# EAGLE design lab5 (EAGLE 7.2.0)
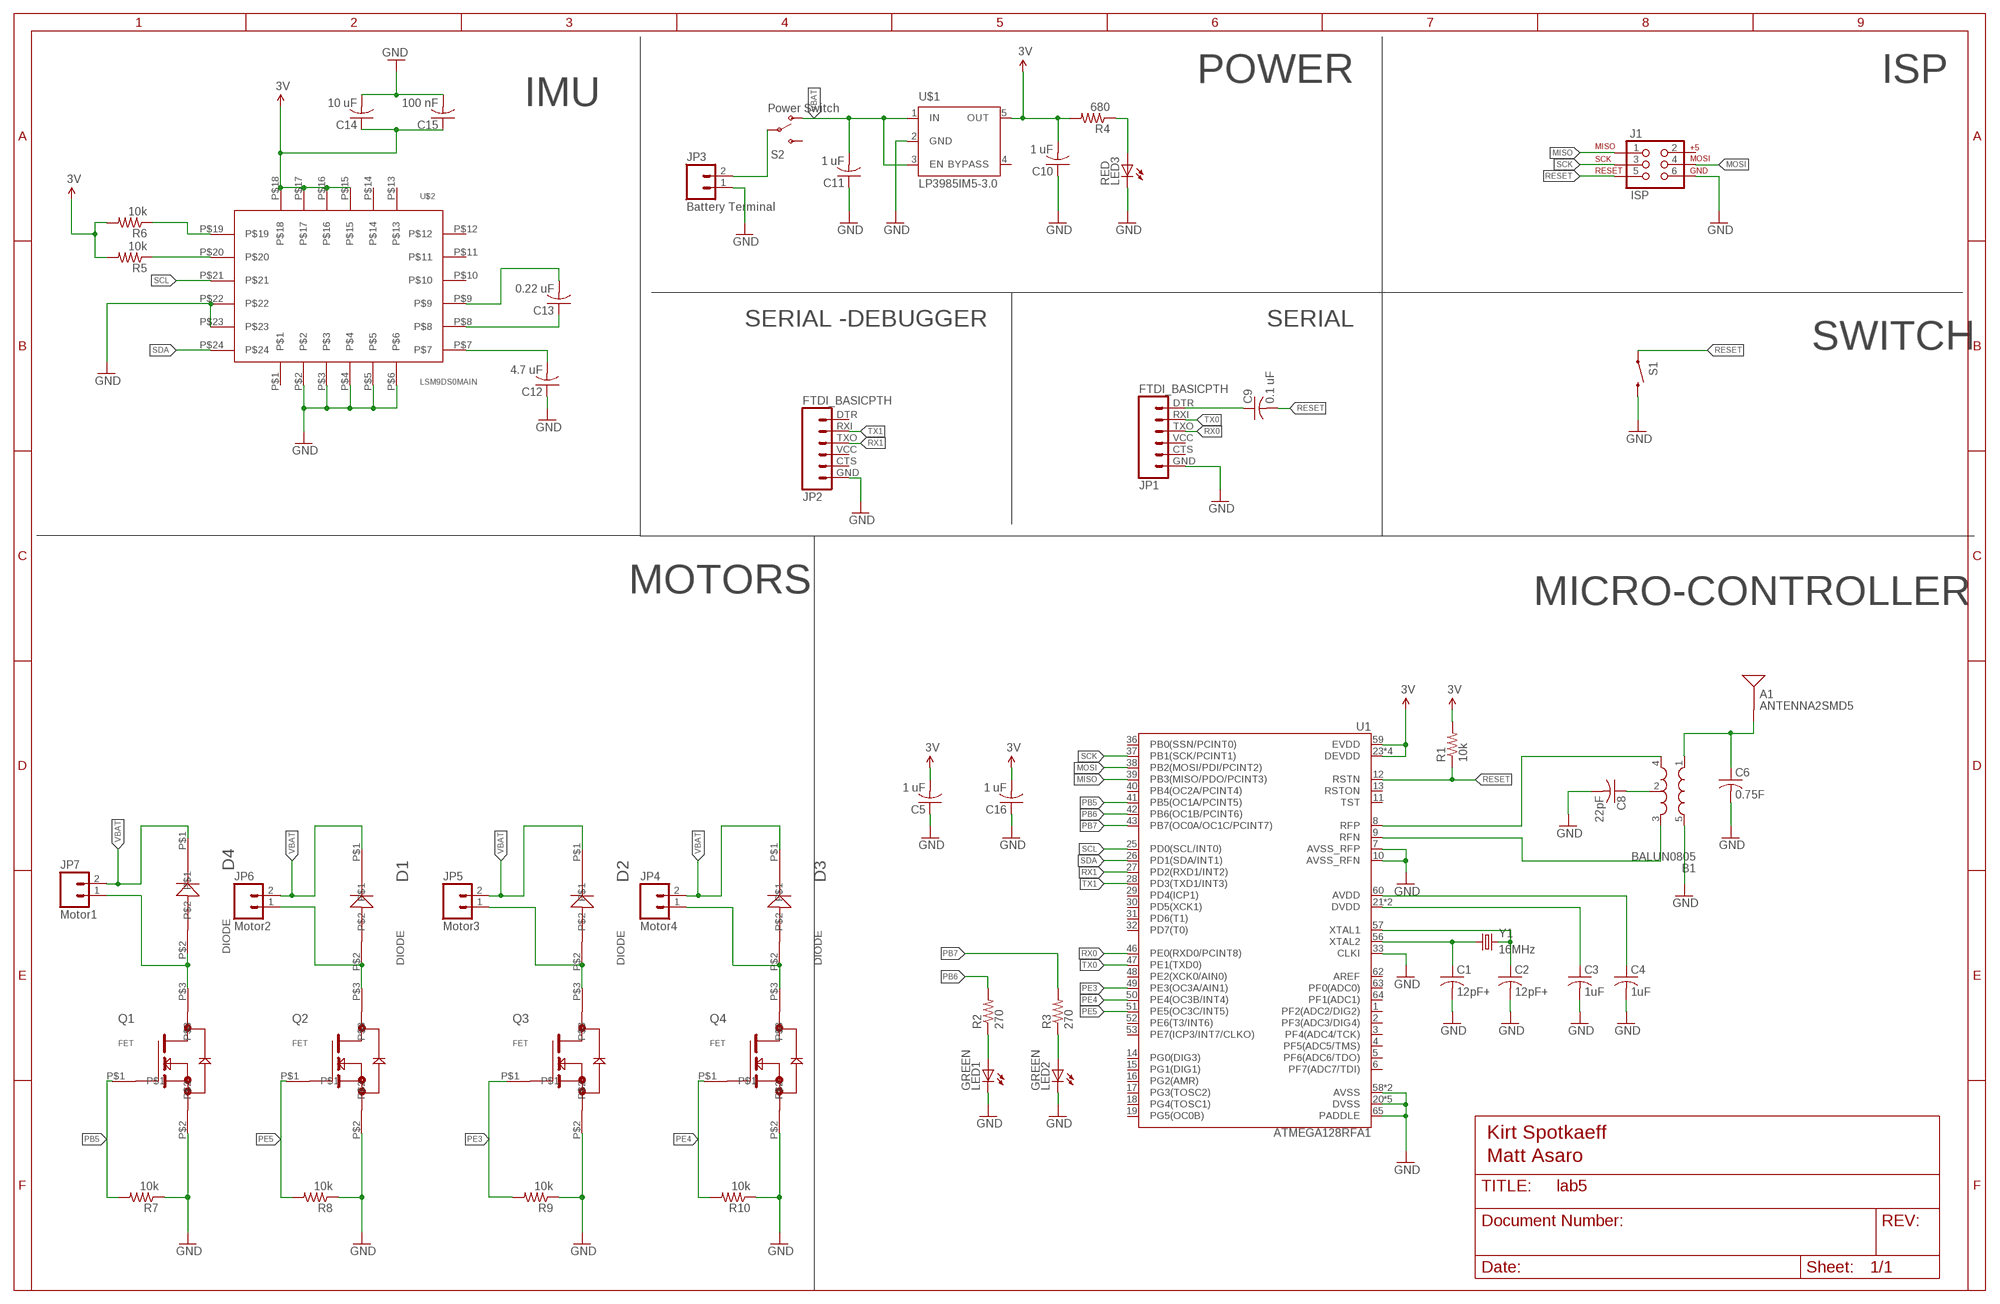
[diagram p0: schematic, sheet 1]

## Parts
A1  ANTENNA2SMD5  [ANTENNA-CHIP5]
B1  BALUN0805  [BALUN]
C1  12pF+  C-USC0805  [C0805]
C2  12pF+  C-USC0805  [C0805]
C3  1uF  C-USC0805  [C0805]
C4  1uF  C-USC0805  [C0805]
C5  1 uF  C-USC0805  [C0805]
C6  0.75F  C-USC0805  [C0805]
C8  22pF  C-USC0805  [C0805]
C9  0.1 uF  C-USC0805  [C0805]
C10  1 uF  C-USC0805  [C0805]
C11  1 uF  C-USC0805  [C0805]
C12  4.7 uF  C-USC0805  [C0805]
C13  0.22 uF  C-USC0805  [C0805]
C14  10 uF  C-USC0805  [C0805]
C15  100 nF  C-USC0805  [C0805]
C16  1 uF  C-USC0805  [C0805]
D1  DIODE  [DIODE]
D2  DIODE  [DIODE]
D3  DIODE  [DIODE]
D4  DIODE  [DIODE]
J1  ISP  AVR_SPI_PRG_6NS  [2X3-NS]
JP1  FTDI_BASICPTH  [FTDI_BASIC]
JP2  FTDI_BASICPTH  [FTDI_BASIC]
JP3  Battery Terminal  M02PTH  [1X02]
JP4  Motor4  M02PTH  [1X02]
JP5  Motor3  M02PTH  [1X02]
JP6  Motor2  M02PTH  [1X02]
JP7  Motor1  M02PTH  [1X02]
LED1  GREEN  LEDCHIP-LED0805  [CHIP-LED0805]
LED2  GREEN  LEDCHIP-LED0805  [CHIP-LED0805]
LED3  RED  LEDCHIP-LED0805  [CHIP-LED0805]
Q1  FET  [FET]
Q2  FET  [FET]
Q3  FET  [FET]
Q4  FET  [FET]
R1  10k  R-US_R0805  [R0805]
R2  270  R-US_R0805  [R0805]
R3  270  R-US_R0805  [R0805]
R4  680  R-US_R0805  [R0805]
R5  10k  R-US_R0805  [R0805]
R6  10k  R-US_R0805  [R0805]
R7  10k  R-US_R0805  [R0805]
R8  10k  R-US_R0805  [R0805]
R9  10k  R-US_R0805  [R0805]
R10  10k  R-US_R0805  [R0805]
S1  SWITCH-MOMENTARY-2SMD  [TACTILE_SWITCH_SMD]
S2  Power Switch  SWITCH-SPDTPTH  [SWITCH-SPDT]
U1  ATMEGA128RFA1  [QFN-64]
U$1  LP3985IM5-3.0  [SOT23-DBV]
U$2  LSM9DS0MAIN  [LSM9DS0]
Y1  16MHz  CRYSTAL5X3  [CRYSTAL-SMD-5X3]

## Nets
3.3V: C5.2 C10.2 C14.1 C15.1 C16.2 R1.2 R4.2 R5.2 R6.2 U1.23(DEVDD) U1.34(DEVDD) U1.44(DEVDD) U1.54(DEVDD) U1.59(EVDD) U$1.5(OUT) U$2.P$15 U$2.P$16 U$2.P$17 U$2.P$18 ; supply symbol labelled 3V
GND: B1.5(GND) C1.2 C2.2 C3.2 C4.2 C5.1 C6.2 C8.2 C10.1 C11.1 C12.1 C14.2 C15.2 C16.1 J1.6 JP1.GND JP2.GND JP3.1 LED1.C LED2.C LED3.C Q1.P$2 Q2.P$2 Q3.P$2 Q4.P$2 R7.1 R8.1 R9.1 R10.1 S1.3 U1.7(AVSS_RFP) U1.10(AVSS_RFN) U1.20(DVSS) U1.24(DVSS) U1.33(CLKI) U1.35(DVSS) U1.45(DVSS) U1.55(DVSS) U1.58(AVSS) U1.61(AVSS) U1.65(PADDLE) U$1.2(GND) U$2.P$2 U$2.P$3 U$2.P$4 U$2.P$5 U$2.P$6 U$2.P$22 U$2.P$23
MISO: J1.1 U1.39(PB3(MISO/PDO/PCINT3))
MOSI: J1.4 U1.38(PB2(MOSI/PDI/PCINT2))
N$1: C1.1 U1.56(XTAL2) Y1.1
N$2: B1.2(GND) C8.1
N$3 [HIGHCURRENT]: D1.P$2 JP6.1 Q2.P$3
N$4 [RFSIG]: A1.FEED(SIGNAL) B1.1(IN) C6.1
N$6: LED3.A R4.1
N$7: JP3.2 S2.2(P)
N$8: LED1.A R2.1
N$9: LED2.A R3.1
N$10: C9.1 JP1.DTR
N$11: C2.1 U1.57(XTAL1) Y1.3
N$12 [HIGHCURRENT]: D3.P$2 JP4.1 Q4.P$3
N$13: C3.1 U1.21(DVDD) U1.22(DVDD)
N$14: C4.1 U1.60(AVDD)
N$15 [HIGHCURRENT]: D2.P$2 JP5.1 Q3.P$3
N$16 [HIGHCURRENT]: D4.P$2 JP7.1 Q1.P$3
N$17: B1.3(OUT2) U1.9(RFN)
N$18: B1.4(OUT1) U1.8(RFP)
N$21: C12.2 U$2.P$7
N$22: C13.2 U$2.P$9
N$23: C13.1 U$2.P$8
N$28: R5.1 U$2.P$20
N$29: R6.1 U$2.P$19
PB5: Q1.P$1 R7.2 U1.41(PB5(OC1A/PCINT5))
PB6: R2.2 U1.42(PB6(OC1B/PCINT6))
PB7: R3.2 U1.43(PB7(OC0A/OC1C/PCINT7))
PE3: Q3.P$1 R9.2 U1.49(PE3(OC3A/AIN1))
PE4: Q4.P$1 R10.2 U1.50(PE4(OC3B/INT4))
PE5: Q2.P$1 R8.2 U1.51(PE5(OC3C/INT5))
RESET: C9.2 J1.5 R1.1 S1.1 U1.12(RSTN)
RX0: JP1.TXO U1.46(PE0(RXD0/PCINT8))
RX1: JP2.TXO U1.27(PD2(RXD1/INT2))
SCK: J1.3 U1.37(PB1(SCK/PCINT1))
SCL: U1.25(PD0(SCL/INT0)) U$2.P$21
SDA: U1.26(PD1(SDA/INT1)) U$2.P$24
TX0: JP1.RXI U1.47(PE1(TXD0))
TX1: JP2.RXI U1.28(PD3(TXD1/INT3))
VBAT [HIGHCURRENT]: C11.2 D1.P$1 D2.P$1 D3.P$1 D4.P$1 JP4.2 JP5.2 JP6.2 JP7.2 S2.1(O) U$1.1(IN) U$1.3(EN)
Unconnected: J1.2 JP1.CTS JP1.VCC JP2.CTS JP2.DTR JP2.VCC S2.3(S) U1.1(PF2(ADC2/DIG2)) U1.2(PF3(ADC3/DIG4)) U1.3(PF4(ADC4/TCK)) U1.4(PF5(ADC5/TMS)) U1.5(PF6(ADC6/TDO)) U1.6(PF7(ADC7/TDI)) U1.11(TST) U1.13(RSTON) U1.14(PG0(DIG3)) U1.15(PG1(DIG1)) U1.16(PG2(AMR)) U1.17(PG3(TOSC2)) U1.18(PG4(TOSC1)) U1.19(PG5(OC0B)) U1.29(PD4(ICP1)) U1.30(PD5(XCK1)) U1.31(PD6(T1)) U1.32(PD7(T0)) U1.36(PB0(SSN/PCINT0)) U1.40(PB4(OC2A/PCINT4)) U1.48(PE2(XCK0/AIN0)) U1.52(PE6(T3/INT6)) U1.53(PE7(ICP3/INT7/CLKO)) U1.62(AREF) U1.63(PF0(ADC0)) U1.64(PF1(ADC1)) U$1.4(BYPASS) U$2.P$1 U$2.P$10 U$2.P$11 U$2.P$12 U$2.P$13 U$2.P$14

## Notes on the sheet
- POWER | ISP
- IMU
- SERIAL -DEBUGGER | SERIAL
- SWITCH
- MOTORS | MICRO-CONTROLLER
- Kirt Spotkaeff
- Matt Asaro

## Library data of the parts
A1 = Lab5:ANTENNA2: Chip antenna Single endded antenna. Common with smaller chip antennas. CHIP4 package is the GPS Chip Antenna SKU: GPS-08418. CHIP5 package is 2.4GHz chip antenna SKU: WRL-00144.
B1 = Lab5:BALUN: 0805 footprint balun- Ember 351/357
C1-C6 C8-C16 = Lab5:C-US: CAPACITOR, American symbol
D1-D4 = Kirt-Lab4:DIODE: BAS16WS Digikey Small Signal Fast Switching Diode Created by Kirt Spotkaeff diode for the motor controller; CREATOR: Kirt Spotkaeff; DIST: Digikey; DISTPN: BAS16WS
J1 = Lab5:AVR_SPI_PRG_6: AVR ISP 6 Pin This is the reduced ISP connector for AVR programming. Common on Arduino. This footprint will take up less PCB space and can be used with a 10-pin to 6-pin adapter such as SKU: BOB-08508
JP1 JP2 = Lab5:FTDI_BASIC: FTDI Basic header with labels
JP3-JP7 = Lab5:M02: Header 2 Standard 2-pin 0.1" header. Use with straight break away headers (SKU : PRT-00116), right angle break away headers (PRT-00553), swiss pins (PRT-00743), machine pins (PRT-00117), and female headers (PRT-00115). Molex polarized connector foot print use with SKU : PRT-08233 with associated crimp pins and housings.
LED1-LED3 = Lab5:LED: LED OSRAM: - CHIPLED LG R971, LG N971, LY N971, LG Q971, LY Q971, LO R971, LY R971 LH N974, LH R974 LS Q976, LO Q976, LY Q976 LO Q996 - Hyper CHIPLED LW Q18S LB Q993, LB Q99A, LB R99A - SideLED LS A670, LO A670, LY A670, LG A670, LP A670 LB A673, LV A673, LT A673, LW A673 LH A674 LY A675 LS A676, LA A676, LO A676, LY A676, LW A676 LS A679, LY A679, LG A679 - Hyper Micro SIDELED® LS Y876, LA Y876, LO Y876, LY Y876 LT Y87S - SmartLED LW L88C, LW L88S LB L89C, LB L89S, LG L890 LS L89K, LO L89K, LY L89K LS L896, LA L896, LO L896, LY L896 - TOPLED LS T670, LO T670, LY T670, LG T670, LP T670 LSG T670, LSP T670, LSY T670, LOP T670, LYG T670 LG T671, LOG T671, LSG T671 LB T673, LV T673, LT T673, LW T673 LH T674 LS T676, LA T676, LO T676, LY T676, LB T676, LH T676, LSB T676, LW T676 LB T67C, LV T67C, LT T67C, LS T67K, LO T67K, LY T67K, LW E67C LS E67B, LA E67B, LO E67B, LY E67B, LB E67C, LV E67C, LT E67C LW T67C LS T679, LY T679, LG T679 LS T770, LO T770, LY T770, LG T770, LP T770 LB T773, LV T773, LT T773, LW T773 LH T774 LS E675, LA E675, LY E675, LS T675 LS T776, LA T776, LO T776, LY T776, LB T776 LHGB T686 LT T68C, LB T68C - Hyper Mini TOPLED® LB M676 - Mini TOPLED Santana® LG M470 LS M47K, LO M47K, LY M47K Source: http://www.osram.convergy.de LUXEON: - LUMILED® LXK2-PW12-R00, LXK2-PW12-S00, LXK2-PW14-U00, LXK2-PW14-V00 LXK2-PM12-R00, LXK2-PM12-S00, LXK2-PM14-U00 LXK2-PE12-Q00, LXK2-PE12-R00, LXK2-PE12-S00, LXK2-PE14-T00, LXK2-PE14-U00 LXK2-PB12-K00, LXK2-PB12-L00, LXK2-PB12-M00, LXK2-PB14-N00, LXK2-PB14-P00, LXK2-PB14-Q00 LXK2-PR12-L00, LXK2-PR12-M00, LXK2-PR14-Q00, LXK2-PR14-R00 LXK2-PD12-Q00, LXK2-PD12-R00, LXK2-PD12-S00 LXK2-PH12-R00, LXK2-PH12-S00 LXK2-PL12-P00, LXK2-PL12-Q00, LXK2-PL12-R00 Source: www.luxeon.com KINGBRIGHT: KA-3528ASYC Source: www.kingbright.com
Q1-Q4 = Kirt-Lab4:FET: The FET for the motor controller Datasheet: Labs/Lab4/datasheets/Si2302DS_MOSFET.pdf; CREATOR: Kirt Spotkaeff; DIST: Digikey
R1-R10 = Lab5:R-US_: RESISTOR, American symbol
S1 = Lab5:SWITCH-MOMENTARY-2: Various NO switches- pushbuttons, reed, etc
S2 = Lab5:SWITCH-SPDT: SPDT Switch Simple slide switch, Spark Fun Electronics SKU : COM-00102 DPDT SMT slide switch, AYZ0202, SWCH-08179; PROD_ID: SWCH-08261
U1 = Lab5:ATMEGA128RFA1: ATmega128RFA1 8-bit AVR Microcontroller with Low Power 2.4GHz Transceiver for ZigBee and IEEE 802.15.4
U$1 = Lab5:LP3985IM5-3.0
U$2 = lab4:LSM9DS0
Y1 = Lab5:CRYSTAL: Various standard crystals. Proven footprints. Spark Fun Electronics SKU : COM-00534

## Net classes
1 RFSIG: width 0.457 mm
2 HIGHCURRENT: width 0.457 mm

## Board
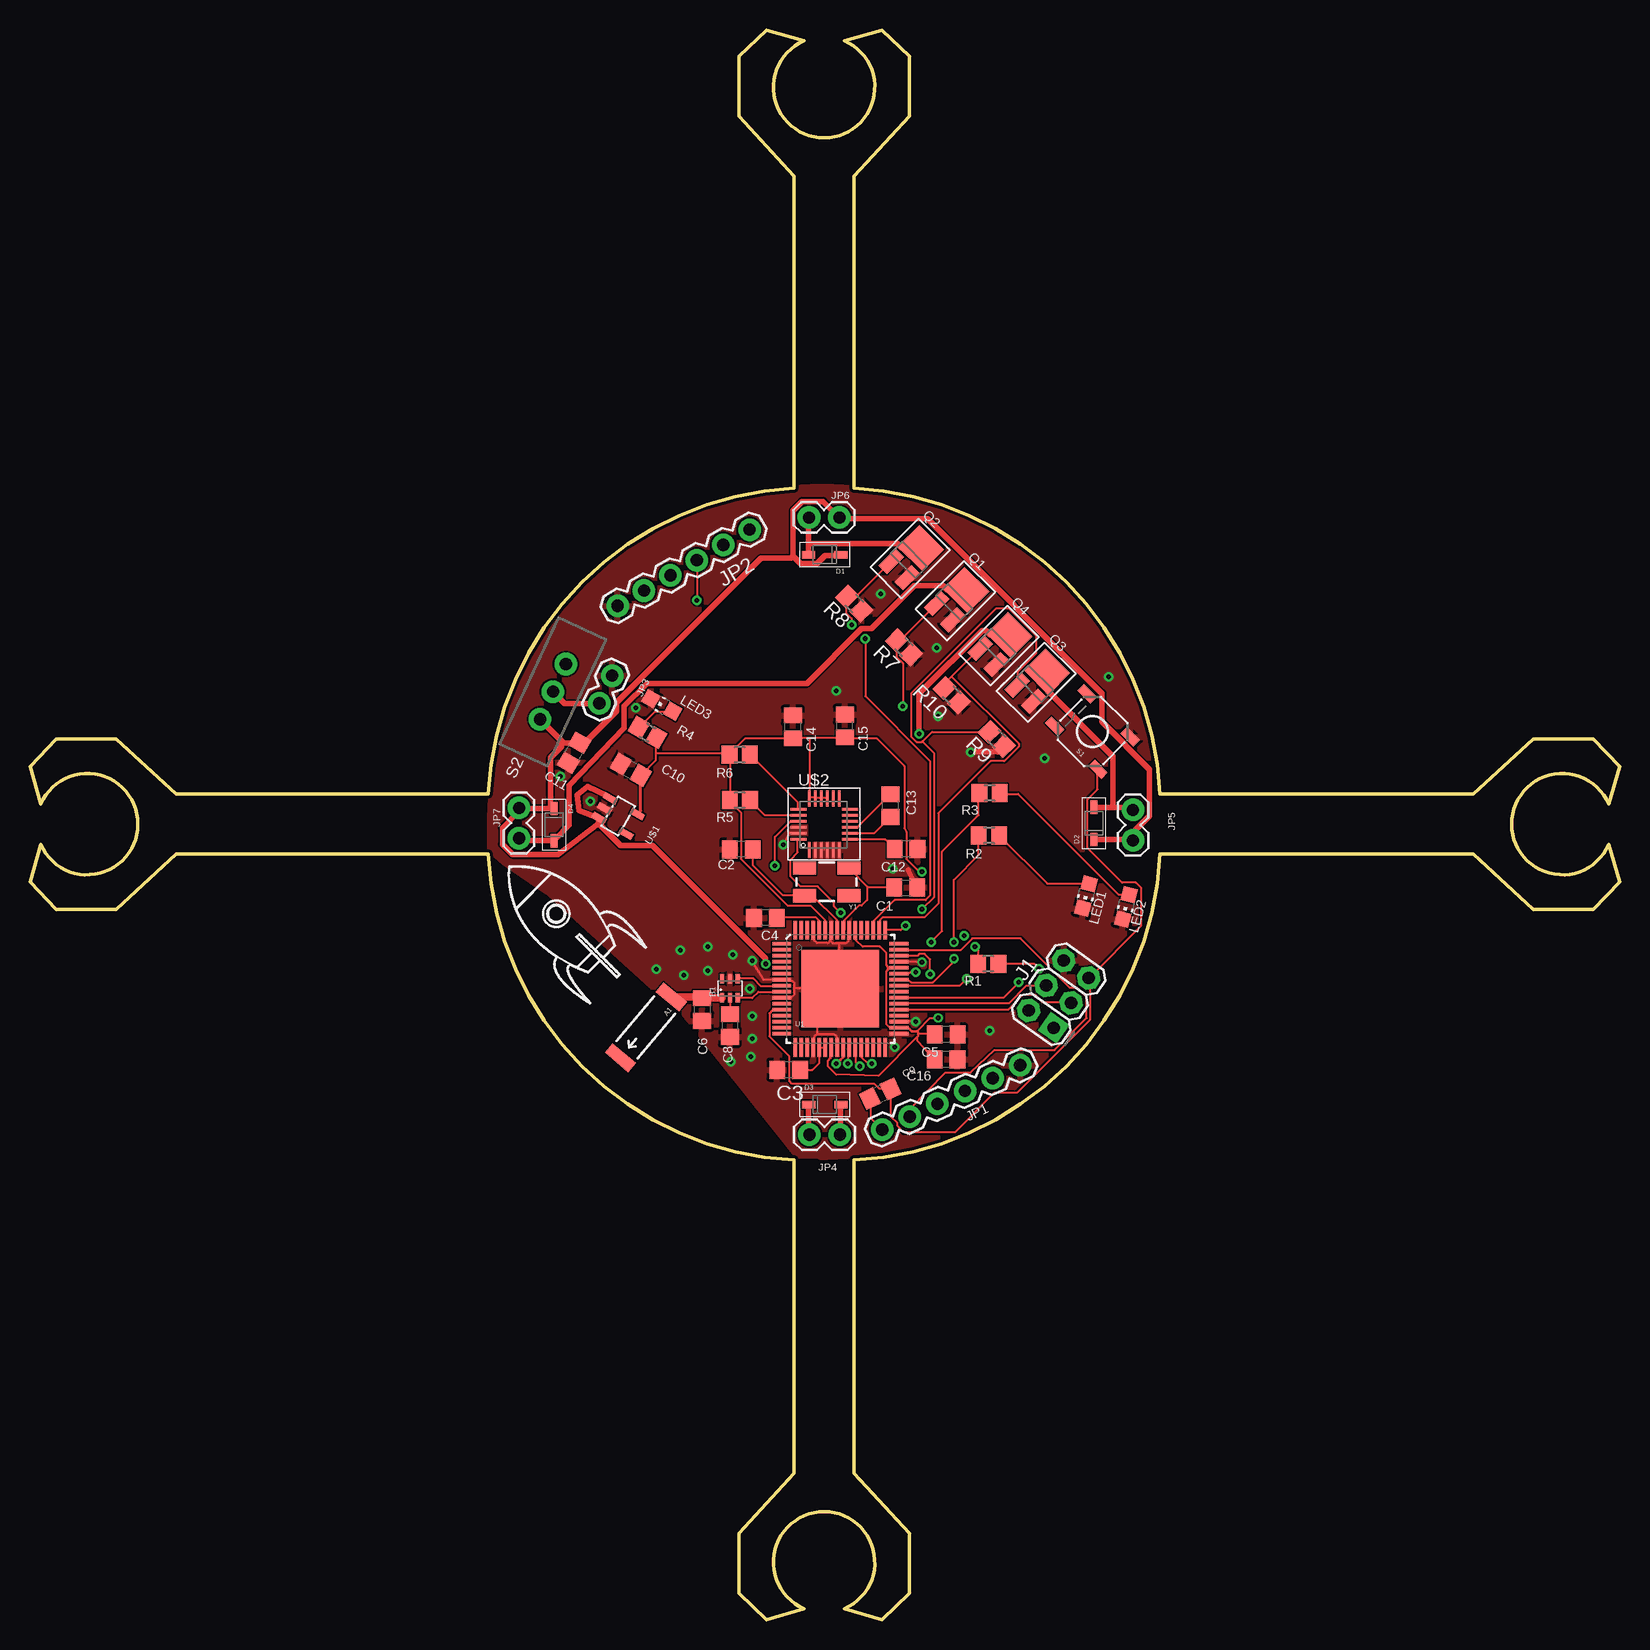
[diagram p1: board, top side]
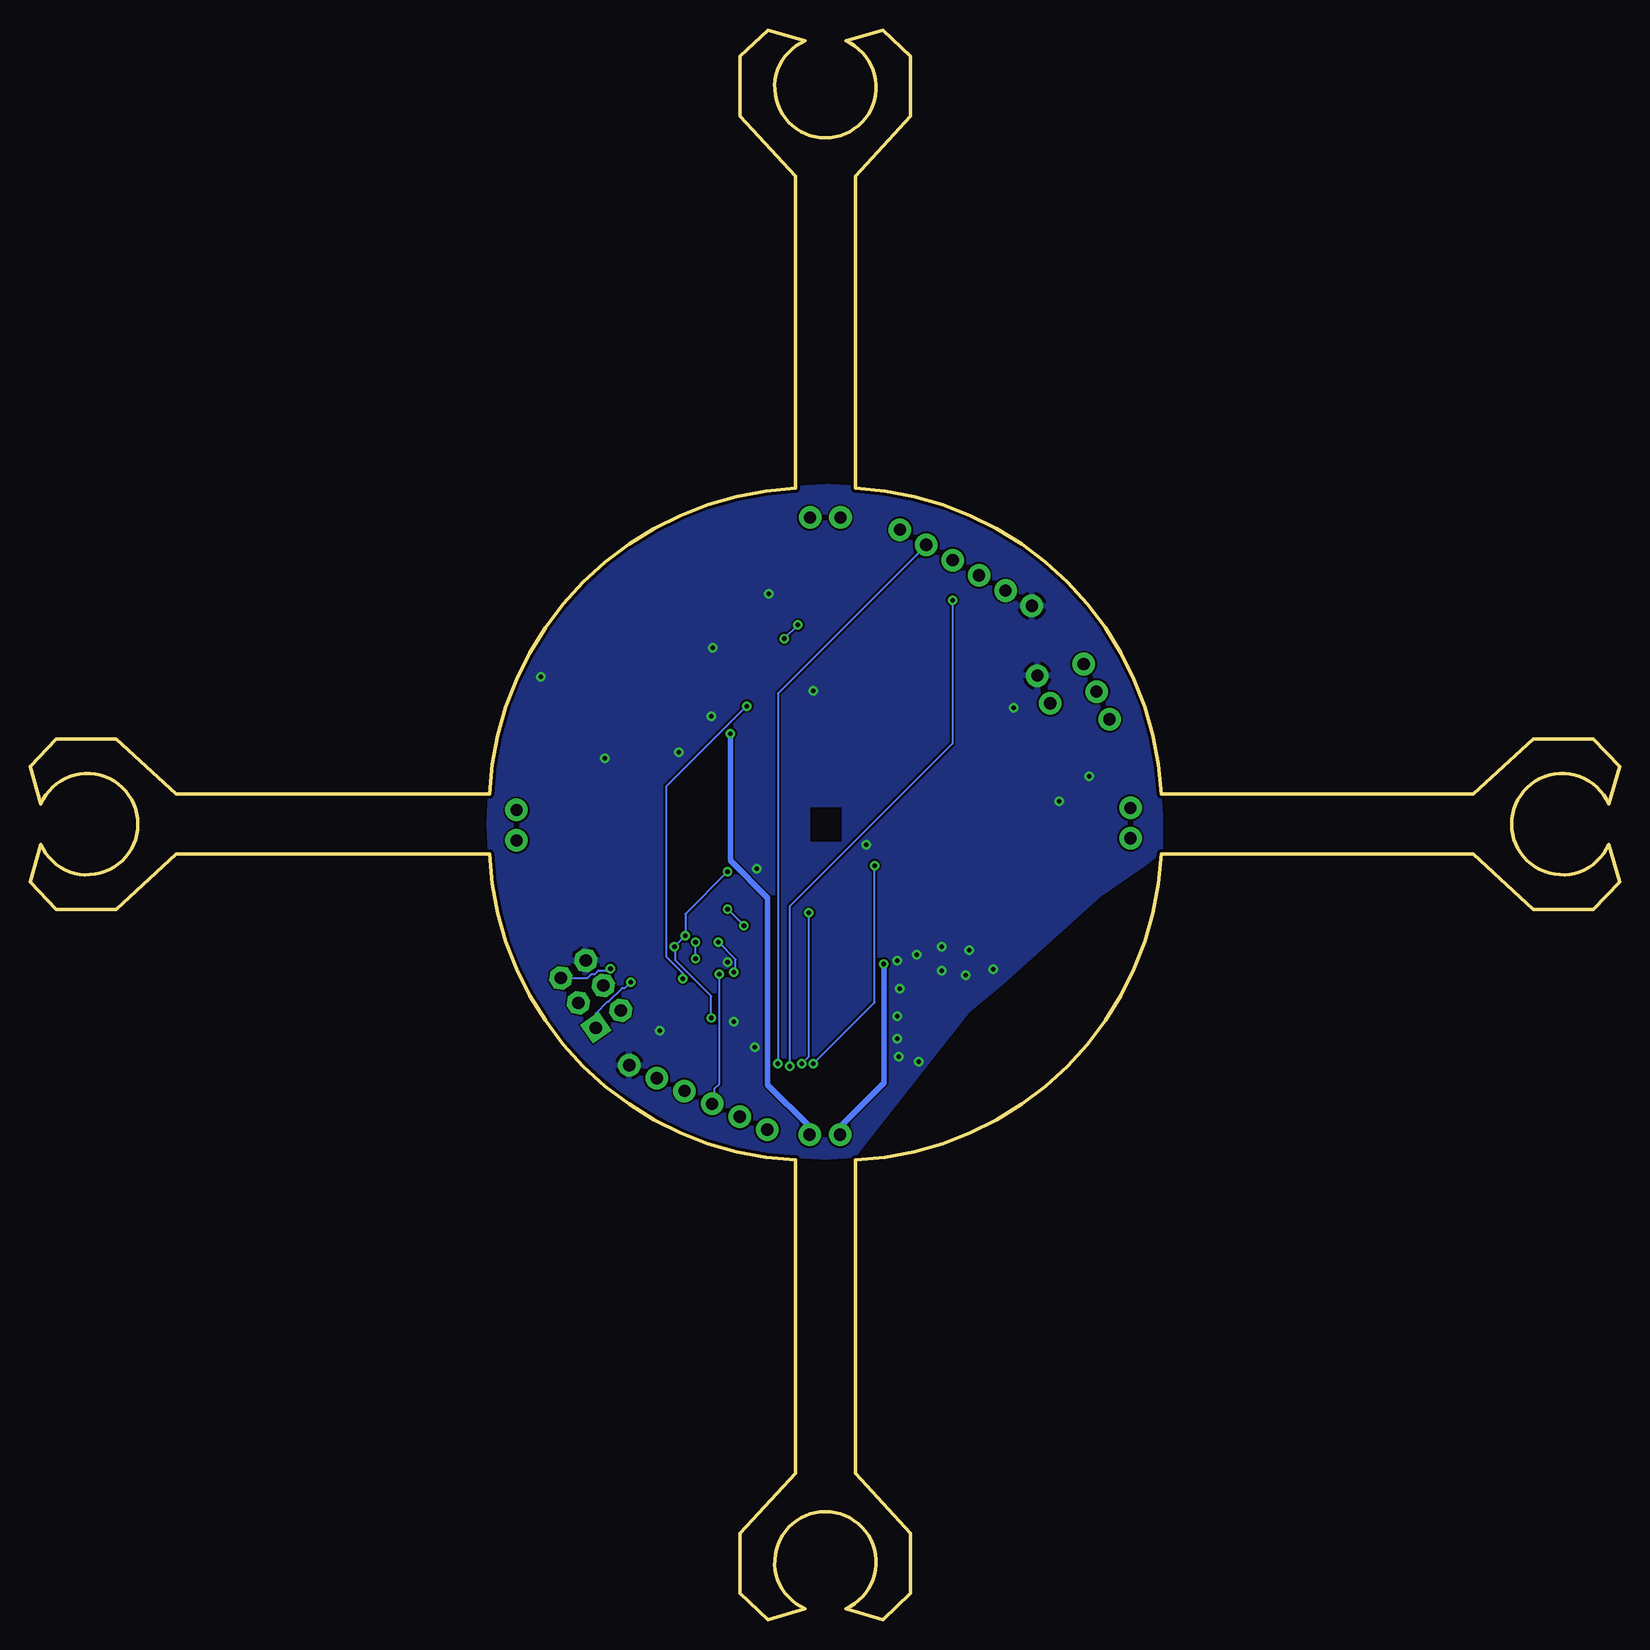
[diagram p2: board, bottom side, seen from below]

Size 132.5 x 132.5 mm. Coordinates in mm from the lower left corner, seen from the top.
Outline: 94.2,63.8 arc-85 68.7,38.3
Outline: 94.2,68.8 arc85 68.7,94.3 68.7,120.3 73.3,125.3 73.3,130.3 71,132.5 67.9,131.6 arc-313 64.5,131.6 61.4,132.5 59.1,130.3 59.1,125.3 63.7,120.3 63.7,94.3 arc85 38.2,68.8 12.2,68.8 7.2,73.4 2.2,73.4 0,71.1 0.9,68 arc-313 0.9,64.6 0,61.5 2.2,59.2 7.2,59.2 12.2,63.8 38.2,63.8 arc85 63.7,38.3
Outline: 68.7,38.2 68.7,12.2 73.3,7.2 73.3,2.2 71,0 67.9,0.9 arc313 64.5,0.9 61.4,0 59.1,2.2 59.1,7.2 63.7,12.2 63.7,38.2
Outline: 94.3,68.8 120.3,68.8 125.3,73.4 130.3,73.4 132.5,71.1 131.6,68 arc313 131.6,64.6 132.5,61.5 130.3,59.2 125.3,59.2 120.3,63.8 94.3,63.8
Copper layers (1*16): Top 0.035559375mm / dielectric 1.501140625mm / Bottom 0.035559375mm
Design rules "4pcb-33board": minimum track width 6mil, minimum drill 15mil, track to track 6mil, track to pad 6mil, pad to pad 6mil, via to via 6mil, smd to smd 6mil, copper to edge 10mil, drill to drill 10mil, minimum pad ring 10mil, minimum via ring 8mil, stop-mask expansion 4mil, vias tented up to drill 0mil, thermal gap 10mil
tRestrict: area 64.9,64.9 to 67.5,67.7; area 38.5,38.5 to 63.5,63.4
bRestrict: area 64.8,64.9 to 67.4,67.7; area 38.5,38.5 to 63.5,63.4
vRestrict: area 64.9,65 to 67.4,67.7

### Footprints (pad centres in the part's own frame; a part is rotated, then mirrored left to right if it is on the bottom)
ANTENNA-CHIP5 = smd 1.016 x 2.54: FEED -3.302,0; NC 3.302,0
BALUN = smd 0.35 x 0.8: 1 -0.65,-0.8; 2 0,-0.8; 3 0.65,-0.8; 4 0.65,0.8; 5 0,0.8; 6 -0.65,0.8
C0805 = smd 1.3 x 1.5: 1 -0.95,0; 2 0.95,0
DIODE = smd 1.1 x 0.6: P$1 -1.35,0; P$2 1.35,0
2X3-NS = drill 1.016 pad 1.88 square: 1 -2.54,-1.27 | drill 1.016 pad 1.88 octagon: 2 -2.54,1.27; 3 0,-1.27; 4 0,1.27; 5 2.54,-1.27; 6 2.54,1.27
FTDI_BASIC = drill 1.016 pad 1.88: CTS 10.16,0; DTR 0,0; GND 12.7,0; RXI 2.54,0; TXO 5.08,0; VCC 7.62,0
1X02 = drill 1.016 pad 1.88: 1 0,0; 2 2.54,0
CHIP-LED0805 = smd 1.2 x 1.2: A 0,-1.05; C 0,1.05
FET = smd 1 x 2: P$1 -0.95,-1.125; P$2 0.95,-1.125 | smd 2.9 x 2.55: P$3 0,1.4
R0805 = smd 1.3 x 1.5: 1 -0.85,0; 2 0.85,0
TACTILE_SWITCH_SMD = smd 1.524 x 0.762: 1 -2.54,1.905; 2 2.54,1.905; 3 -2.54,-1.905; 4 2.54,-1.905
SWITCH-SPDT = drill 1.016 pad 1.88: 1 0,2.54; 2 0,0; 3 0,-2.54
QFN-64 = smd 1.562 x 0.28: 1 -4.881,3.75; 2 -4.881,3.25; 3 -4.881,2.75; 4 -4.881,2.25; 5 -4.881,1.75; 6 -4.881,1.25; 7 -4.881,0.75; 8 -4.881,0.25; 9 -4.881,-0.25; 10 -4.881,-0.75; 11 -4.881,-1.25; 12 -4.881,-1.75; 13 -4.881,-2.25; 14 -4.881,-2.75; 15 -4.881,-3.25; 16 -4.881,-3.75; 33 4.881,-3.75; 34 4.881,-3.25; 35 4.881,-2.75; 36 4.881,-2.25; 37 4.881,-1.75; 38 4.881,-1.25; 39 4.881,-0.75; 40 4.881,-0.25; 41 4.881,0.25; 42 4.881,0.75; 43 4.881,1.25; 44 4.881,1.75; 45 4.881,2.25; 46 4.881,2.75; 47 4.881,3.25; 48 4.881,3.75 | smd 0.28 x 1.562: 17 -3.75,-4.881; 18 -3.25,-4.881; 19 -2.75,-4.881; 20 -2.25,-4.881; 21 -1.75,-4.881; 22 -1.25,-4.881; 23 -0.75,-4.881; 24 -0.25,-4.881; 25 0.25,-4.881; 26 0.75,-4.881; 27 1.25,-4.881; 28 1.75,-4.881; 29 2.25,-4.881; 30 2.75,-4.881; 31 3.25,-4.881; 32 3.75,-4.881; 49 3.75,4.881; 50 3.25,4.881; 51 2.75,4.881; 52 2.25,4.881; 53 1.75,4.881; 54 1.25,4.881; 55 0.75,4.881; 56 0.25,4.881; 57 -0.25,4.881; 58 -0.75,4.881; 59 -1.25,4.881; 60 -1.75,4.881; 61 -2.25,4.881; 62 -2.75,4.881; 63 -3.25,4.881; 64 -3.75,4.881 | smd 6.452 x 6.452: 65 0,0
SOT23-DBV = smd 0.55 x 1.2: 1 -0.95,-1.3; 2 0,-1.3; 3 0.95,-1.3; 4 0.95,1.3; 5 -0.95,1.3
LSM9DS0 = smd 0.2 x 1.35: P$1 -1.25,-2.15; P$2 -0.75,-2.15; P$3 -0.25,-2.15; P$4 0.25,-2.15; P$5 0.75,-2.15; P$6 1.25,-2.15; P$13 1.25,2.15; P$14 0.75,2.15; P$15 0.25,2.15; P$16 -0.25,2.15; P$17 -0.75,2.15; P$18 -1.25,2.15 | smd 1.35 x 0.2: P$7 2.15,-1.25; P$8 2.15,-0.75; P$9 2.15,-0.25; P$10 2.15,0.25; P$11 2.15,0.75; P$12 2.15,1.25; P$19 -2.15,1.25; P$20 -2.15,0.75; P$21 -2.15,0.25; P$22 -2.15,-0.25; P$23 -2.15,-0.75; P$24 -2.15,-1.25
CRYSTAL-SMD-5X3 = smd 1.9 x 1.1: 1 -1.85,-1.15; 2 1.85,-1.15; 3 1.85,1.15; 4 -1.85,1.15

### Placement (x,y rotation side)
A1  51.34,49.36 230 top
B1  58.35,52.62 0 top
C1  73.01,61 0 top
C2  59.3,64.2 180 top
C3  63.24,45.82 180 top
C4  61.3,58.5 180 top
C5  76.37,48.77 180 top
C6  56.03,50.85 270 top
C8  58.34,49.52 270 top
C9  70.88,43.83 25 top
C10  50.09,70.84 330 top
C11  45.34,72.26 60 top
C12  73.03,64.22 180 top
C13  71.74,67.84 90 top
C14  63.6,74.42 90 top
C15  67.92,74.49 90 top
C16  76.37,46.7 180 top
D1  66.24,88.76 180 top
D2  88.68,66.36 90 top
D3  66.27,42.92 0 top
D4  43.7,66.27 270 top
J1  85.75,52.13 55 top
JP1  71.04,40.84 25 top
JP2  59.98,90.85 210 top
JP3  48.53,78.68 245 top
JP4  67.51,40.42 180 top
JP5  91.95,67.49 270 top
JP6  64.94,91.86 0 top
JP7  40.76,65.12 90 top
LED1  88.02,60.3 165 top
LED2  91.35,59.4 165 top
LED3  52.66,76.22 60 top
Q1  77.05,84.81 315 top
Q2  73.27,88.32 315 top
Q3  83.77,78.01 315 top
Q4  80.66,81.07 315 top
R1  79.88,54.66 180 top
R2  79.95,65.35 180 top
R3  79.99,68.89 180 top
R4  51.49,73.94 330 top
R5  59.17,68.3 180 top
R6  59.16,72.09 180 top
R7  72.85,81.04 135 top
R8  68.7,84.68 135 top
R9  80.58,73.4 135 top
R10  76.84,77.05 135 top
S1  88.57,74.02 135 top
S2  43.59,77.35 155 top
U1  67.56,52.57 0 top
U$1  49.03,66.97 240 top
U$2  66.2,66.3 0 top
U$3  [ROCKET_LOGO]  46.48,50.98 45 top
Y1  66.42,61.48 180 top

### Tracks (layer width: path | path; a pad name or v marks a point on that pad's centre or on a via)
3.3V  (via drill 0.38)
  Top 0.152: v78.77,56.09 79,55.86 79,54.72 R1.2 | 71.57,54.38 71.61,54.34 72.37,54.34 U1.44 | 71.57,54.38 71.38,54.56 71.38,55.56 70.85,56.09 69.4,56.09 68.87,56.62 68.87,57.38 U1.54 | 74,48.6 74.02,48.62 74.02,48.8 | 74,48.6 70.72,45.32 67.19,45.42 66.51,46.11 66.51,46.56 66.73,46.79 66.73,47.63 U1.23 | 74.02,48.8 74.02,49 73.48,49.04 | 73.48,49.04 73.21,49.31 72.45,49.31 U1.34 72.37,49.38 71.61,49.38 71.38,49.61 71.38,54.03 71.53,54.18 71.53,54.34 71.57,54.38 | v75.73,50.15 75.04,50.15 73.97,49.08 73.52,49.08 73.48,49.04 | U$2.P$15 66.43,68.51 65.97,68.51 U$2.P$16 65.89,68.51 65.51,68.51 U$2.P$17 65.44,68.51 64.98,68.51 U$2.P$18 64.98,68.59 64.98,73.46 | 64.98,73.46 67.88,73.46 C15.1 67.95,73.46 70.54,73.46 72.88,71.13 72.88,65.98 73.06,65.66 73.06,63.4 74.12,62.34 v74.35,62.34 | 64.98,73.46 C14.1 63.53,73.46 59.65,73.46 58.35,72.17 R6.2 | 52.18,72.17 52.18,71.63 50.96,70.41 C10.2 | 52.18,72.17 52.18,73.46 R4.2 | R6.2 58.35,72.09 58.35,68.36 R5.2 58.28,68.28 59.27,67.29 59.27,63.4 63.15,59.52 65.06,59.52 66.28,58.3 66.28,57.46 U1.59 | 52.18,72.17 58.28,72.17 R6.2 | C5.2 75.35,48.8 74.02,48.8 | C16.2 74,48.22 74,48.6
  Top 0.254: U$1.5 50.92,67.43 C10.2
  Bottom 0.152: v75.73,50.15 75.73,51.97 78.7,54.95 78.7,56.09 v78.77,56.09 v77.86,57 77.86,58.83 v74.35,62.34
GND  (via drill 0.38)
  Top 0.152: v73.82,49.84 72.45,49.84 U1.35 | v74.35,54.79 72.45,54.79 U1.45 | 66.7,56.58 66.73,56.62 66.73,57.38 U1.58 | 66.7,56.58 66.51,56.39 65.59,56.39 65.36,56.62 65.36,57.38 U1.61 | 67.5,56.39 66.89,56.39 66.7,56.58 | 67.5,56.39 68.03,56.39 68.26,56.62 68.26,57.38 U1.55 | 65.59,48.77 65.36,48.55 65.36,47.71 U1.20 | 65.59,48.77 67.04,48.77 67.27,48.55 67.27,47.71 U1.24 | 63.69,52.58 63.69,53.12 63.53,53.27 62.7,53.27 U1.7 61.18,53.32 v60.2,54.9 | 63.69,52.58 63.69,52.05 63.46,51.82 62.7,51.82 U1.10 | 65.59,52.58 67.5,52.58 U1.65 | 65.59,52.58 63.69,52.58 | 65.59,52.58 65.59,48.77 | 65.59,52.58 U1.65 | 67.5,56.39 67.5,52.66 U1.65 | 66.2,64.17 66.2,64.15 | U$2.P$23 63.25,65.55 v62.8,64.6
  Top 0.406: R9.1 80.68,72.3 v78.4,72.3 | C1.2 73.56,61.74 73.2,62.5
  other vias: 58.4,46.5 60.2,50.3 56.5,56.1 54.2,55.8 60.1,46.9 58.6,55.4 60.2,48.4 60,52.6 54.5,53.7 56.5,54.1 52.2,54.2 44.2,70.3 46.7,68.2 75.6,81 84.6,71.8 75.7,75.3 89.9,78.6 71.9,62.6 67.2,77.4 50.5,76 70.9,85.5 72.1,47.7 80,49.1
  pour Bottom: 65.85,38.58 66.48,38.58 arc90 94.2,66.3 94.2,66.34 arc90 66.1,94.44 65.92,94.44 arc90 38.3,66.82 38.3,64.02 39.46,62.86 43.72,59.56 54.06,50.32 62.32,40.18 63.75,38.68
  pour Top: 65.85,38.58 66.48,38.58 arc90 94.2,66.3 94.2,66.34 arc90 66.1,94.44 65.92,94.44 arc90 38.3,66.82 38.3,64.02 39.26,62.96 42.92,60.16 54.06,50.32 63.72,38.68 65.75,38.68
MISO  (via drill 0.38)
  Top 0.152: v82.43,53.12 81.14,51.82 U1.39
  Bottom 0.152: v82.43,53.12 82.89,52.66 83.12,52.66 84.26,51.52 84.34,51.52 85.33,50.53 85.33,49.38 J1.1
MOSI
  Top 0.152: U1.38 72.45,51.36 81.59,51.36 83.04,52.81 84.64,52.81 J1.4
N$1
  Top 0.152: 69.82,61.08 68.33,62.57 Y1.1 | 69.82,61.08 69.86,61.04 71.99,61.04 C1.1 | U1.56 67.88,57.46 67.88,58.3 69.1,59.52 69.32,59.52 69.78,59.97 69.78,61.04 69.82,61.08
N$2
  Top 0.152: B1.2 58.34,51.81 C8.1
N$3
  Top 0.457: 64.91,89.69 64.91,91.83 JP6.1 | 64.91,89.69 64.91,88.78 D1.P$2 | 64.91,89.69 72.3,89.69 72.68,89.31 74.2,89.31 Q2.P$3
N$4
  Top 0.61: B1.1 57.67,51.8 C6.1 55.94,51.89 A1.FEED
N$6
  Top 0.152: LED3.A 53.55,75.67 52.1,75.67 50.81,74.38 R4.1
N$7
  Top 0.152: 47.45,76.44 JP3.2
  Top 0.457: JP3.2 44.54,76.37 43.59,77.33 S2.2
N$8
  Top 0.152: LED1.A 88.22,61.35 84.79,61.35 80.83,65.31 R2.1
N$9
  Top 0.152: LED2.A 91.58,60.43 90.74,60.43 82.35,68.81 80.91,68.81 R3.1
N$10
  Top 0.152: C9.1 70.09,43.36 70.09,41.76 71,40.85 JP1.DTR
N$11
  Top 0.152: C2.1 60.26,64.17 60.26,62.87 62.77,60.36 64.52,60.36 Y1.3 64.6,60.28 65.29,60.28 67.27,58.3 67.27,57.46 U1.57
N$12  (via drill 0.38)
  Top 0.457: D3.P$2 67.57,42.91 67.57,40.47 JP4.1 | v74.12,73.84 74.12,77.2 79.38,82.45 79.69,82.45 80.07,82.07 81.59,82.07 Q4.P$3
  Bottom 0.457: v74.12,73.84 74.12,63.25 71,60.13 71,44.58 67.57,41.15 67.57,40.47 JP4.1
N$13
  Top 0.152: U1.22 66.28,47.71 65.82,47.71 U1.21 65.8,46.4 65.22,45.82 C3.1
N$14
  Top 0.152: U1.60 65.74,57.46 65.74,58.3 65.51,58.53 62.25,58.53 C4.1
N$15
  Top 0.457: 90.28,67.67 91.73,67.67 91.88,67.52 JP5.1 | 90.28,67.67 88.68,67.67 D2.P$2 | 90.28,67.67 90.28,71.94 84.79,77.42 84.79,78.95 Q3.P$3
N$16
  Top 0.457: JP7.1 40.83,65.08 40.98,64.93 43.65,64.93 D4.P$2 43.8,65.08 44.95,66.23 44.95,69.54 49.51,74.3 49.51,76.13 51.42,78.03 64.75,78.03 69.32,82.61 70.16,82.61 73.74,86.19 76.11,86.19 76.49,85.81 78.01,85.81 Q1.P$3
N$17
  Top 0.152: U1.9 60.72,52.32 60.2,51.8 59.02,51.8 B1.3
N$18
  Top 0.152: U1.8 60.9,52.82 60.3,53.42 B1.4
N$21
  Top 0.152: U$2.P$7 68.41,65 71.31,65 72.07,64.24 C12.2
N$22
  Top 0.152: U$2.P$9 68.99,66.05 C13.2
N$23
  Top 0.152: U$2.P$8 70.39,65.55 C13.1
N$28
  Top 0.152: U$2.P$20 63.99,67.06 61.25,67.06 60.03,68.28 R5.1
N$29
  Top 0.152: U$2.P$19 63.99,67.59 63.99,68.13 60.03,72.09 R6.1
PB5  (via drill 0.38)
  Top 0.152: Q1.P$1 75.57,84.66 72.6,81.69 72.3,81.69 R7.2 72.22,81.62 72.22,80.25 72.75,79.71 v72.75,76.13 | v78.09,53.42 77.48,52.81 U1.41
  Bottom 0.152: v78.09,53.42 78.09,53.88 79.46,55.25 79.46,69.42 v72.75,76.13
PB6  (via drill 0.38)
  Top 0.152: v77.02,56.47 77.02,61.65 79.08,63.71 79.08,65.31 R2.2 | v77.02,55.1 77.02,54.87 75.27,53.12 73.44,53.12 73.29,53.27 72.45,53.27 U1.42
  Bottom 0.152: v77.02,55.1 v77.02,56.47
PB7  (via drill 0.38)
  Top 0.152: v75.12,56.47 76.03,57.38 76.03,64.01 79.08,67.06 79.08,68.81 R3.2 | v73.82,53.96 73.36,53.96 73.29,53.88 72.45,53.88 U1.43
  Bottom 0.152: v75.12,56.47 73.67,55.02 73.67,54.11 v73.82,53.96
PE3  (via drill 0.38)
  Top 0.152: 74.39,73.2 74.35,73.16 73.9,73.16 73.44,73.61 73.44,77.2 80.53,84.28 81.59,84.28 83.88,82 83.88,80.55 82.35,79.02 82.35,77.96 Q3.P$1 | 74.39,73.2 75.19,74 79.92,74 R9.2 | v72.98,57.84 72.6,57.46 71.38,57.46 U1.49 | v74.35,59.21 75.34,60.2 75.34,72.24 74.39,73.2
  Bottom 0.152: v74.35,59.21 v72.98,57.84
PE4
  Top 0.152: 76.83,78.61 79.15,80.93 Q4.P$1 | 76.83,78.61 76.26,78.03 76.26,77.65 R10.2 | 76.83,78.61 82.43,73.01 82.43,72.78 81.21,71.56 80.07,71.56 75.73,67.21 75.73,59.67 74.58,58.53 71.08,58.53 70.85,58.3 70.85,57.46 U1.50
PE5  (via drill 0.38)
  Top 0.152: Q2.P$1 71.76,88.17 68.94,85.35 68.11,85.35 R8.2 68.03,85.27 68.03,83.9 68.49,83.44 v68.49,82.91 | v69.63,81.77 69.63,76.97 75.04,71.56 75.04,60.36 74.66,59.97 72.07,59.97 70.31,58.22 U1.51
  Bottom 0.152: v68.49,82.91 v69.63,81.77
RESET  (via drill 0.38)
  Top 0.152: U1.12 62.62,50.75 61.86,50.75 61.63,50.53 61.63,48.62 63.3,46.95 63.3,44.9 63.54,44.66 70.39,44.66 70.77,44.28 71.69,44.28 C9.2 71.76,44.2 71.76,41.92 72.3,41.38 72.3,41.15 72.83,40.62 77.1,40.62 80.37,43.9 82.28,43.9 88.37,49.99 88.37,53.5 J1.5 88.3,53.5 92.64,57.84 92.64,60.97 92.18,61.42 91.04,61.42 88.15,64.32 88.15,68.36 88.98,69.2 88.98,70.87 S1.1 | v84.11,54.26 83.73,54.64 80.75,54.64 R1.1
  Bottom 0.152: v84.11,54.26 84.26,54.11 85.1,54.11 85.4,53.8 85.71,53.8 86.01,53.5 88.22,53.5 J1.5
RX0  (via drill 0.38)
  Top 0.152: v75.04,53.8 75.04,55.02 74.58,55.48 74.12,55.48 73.97,55.33 U1.46
  Bottom 0.152: v75.04,53.8 75.04,44.66 75.42,44.28 75.42,43.21 75.57,43.06 JP1.TXO
RX1  (via drill 0.38)
  Top 0.152: v69.17,46.11 68.87,46.41 68.87,47.63 U1.27 | JP2.TXO v55.59,84.98 v55.59,84.97
  Bottom 0.152: v69.17,46.11 69.17,59.44 55.59,73.02 v55.59,84.97
SCK
  Top 0.152: U1.37 72.45,50.83 81.52,50.83 82.73,52.05 83.8,52.05 84.41,51.44 86.77,51.44 J1.3
SCL  (via drill 0.38)
  Top 0.152: v62.1,62.84 62.1,65.25 63.38,66.53 63.99,66.53 U$2.P$21 | v67.19,46.34 67.5,46.64 67.57,46.64 67.8,46.87 67.8,47.63 U1.25
  Bottom 0.152: v62.1,62.84 62.1,51.43 v67.19,46.34
SDA  (via drill 0.38)
  Top 0.152: v67.57,58.91 67.04,59.44 67.04,59.75 65.67,61.12 64.22,61.12 63.38,61.96 63.38,63.33 63.99,63.94 63.99,65 U$2.P$24 | v68.18,46.34 68.18,47.55 68.26,47.63 U1.26
  Bottom 0.152: v67.57,58.91 67.57,46.94 v68.18,46.34
TX0
  Top 0.152: U1.47 72.45,55.78 77.55,55.78 78.54,56.77 82.58,56.77 86.7,52.66 87.31,52.66 88.07,51.9 88.07,50.15 85.4,47.48 80.38,47.48 78.4,45.6 76.3,45.6 73.36,42.56 73.36,41.92 JP1.RXI
TX1  (via drill 0.38)
  Top 0.152: v70.16,46.34 69.86,46.34 69.32,46.87 69.32,47.63 U1.28
  Bottom 0.152: v70.16,46.34 70.16,77.2 JP2.RXI
VBAT  (via drill 0.38)
  Top 0.457: D2.P$1 91.88,65 JP5.2 91.96,65.23 91.96,65.61 93.33,66.99 93.33,70.87 89.37,74.83 89.37,77.2 74.81,91.75 67.65,91.75 JP6.2 67.42,91.9 66.12,93.2 64.37,93.2 63.61,92.44 63.61,88.63 | 63.61,88.63 64.22,88.02 65.59,88.02 66.28,88.7 67.57,88.7 D1.P$1 | 44.48,73.08 45.78,73.08 C11.2 46.01,73.16 46.31,73.16 48.9,75.75 48.9,76.44 60.94,88.47 63.46,88.47 63.61,88.63 | 44.48,73.08 42.58,74.99 S2.1 | D3.P$1 64.91,42.91 64.91,40.47 JP4.2 | U$1.1 48.31,68.49 48.16,68.64 46.5,69.44 45.59,68.73 45.79,67.42 47.4,66.81 U$1.3 47.4,66.59 47.4,66.36 | 47.4,66.36 44.03,63.78 40.22,63.78 39.38,64.62 39.38,65.99 40.75,67.37 JP7.2 40.83,67.59 43.65,67.59 D4.P$1 43.42,67.75 43.42,71.86 44.33,72.78 44.33,72.93 44.48,73.08 | v61.32,54.65 61.32,55.1 51.89,64.53 49.23,64.53 47.4,66.36
  Bottom 0.457: v61.32,54.65 61.32,44.73 64.91,41.15 64.91,40.47 JP4.2